# EAGLE schematic Tractive System Schematic (EAGLE 9.6.2)
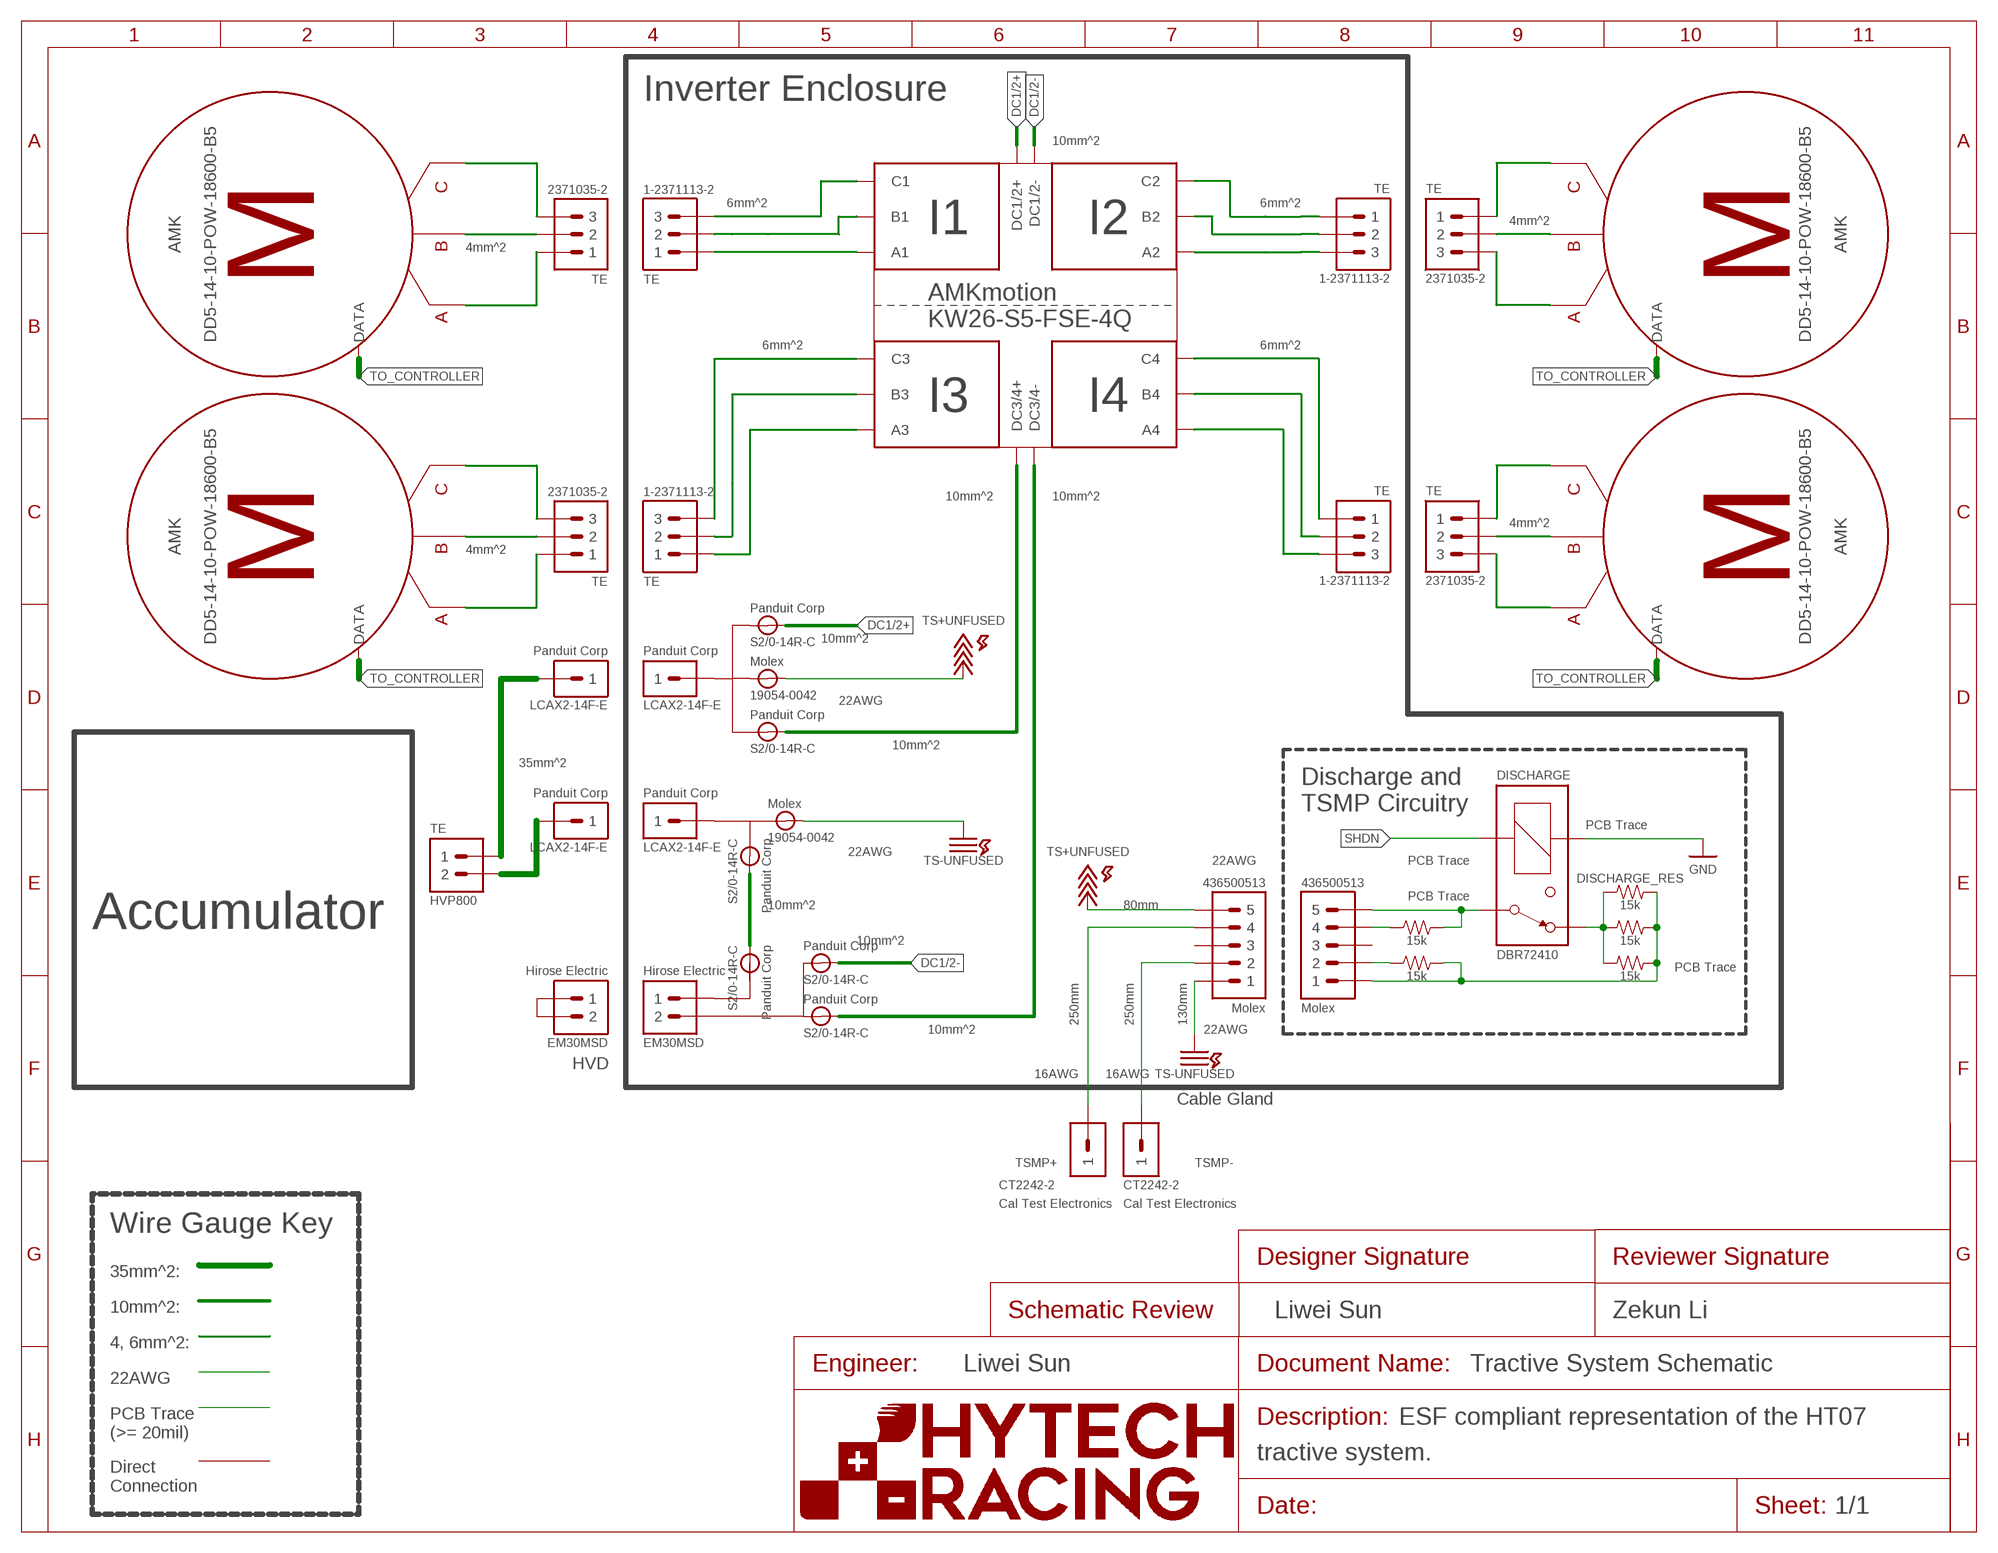
[diagram p0: schematic, sheet 1]
U$4 (FRAME_SCHEMATIC_ONLY): DESCRIPTION_1: ESF compliant representation of the HT07; DESCRIPTION_2: tractive system.; DESIGNER_SCHEMATIC: Liwei Sun; ENGINEER: Liwei Sun; REVIEWER_SCHEMATIC: Zekun Li

## Parts
DISCHARGE  RELAY_SPST_NC_DBR72410  (no package)
DISCHARGE_RES  15k  RESISTOR  (no package)
DISCHARGE_RES1  15k  RESISTOR  (no package)
DISCHARGE_RES2  15k  RESISTOR  (no package)
J1  CONNECTOR-1_CT2242-2  (no package)
J2  CONNECTOR-1_LCAX2-14F-E  (no package)
J3  CONNECTOR-1_CT2242-2  (no package)
J4  RING_TERMINAL_10MM2  (no package)
J5  CONNECTOR-3_2371035-2  (no package)
J6  CONNECTOR-3_2371035-2  (no package)
J7  CONNECTOR-3_2371035-2  (no package)
J8  CONNECTOR-3_2371035-2  (no package)
J9  CONNECTOR-3_1-2371113-2  (no package)
J10  CONNECTOR-3_1-2371113-2  (no package)
J11  CONNECTOR-3_1-2371113-2  (no package)
J12  CONNECTOR-1_LCAX2-14F-E  (no package)
J13  CONNECTOR-3_1-2371113-2  (no package)
J14  RING_TERMINAL_10MM2  (no package)
J15  CONNECTOR-5_436500513  (no package)
J16  CONNECTOR-2_HIROSE  (no package)
J17  CONNECTOR-2_HIROSE  (no package)
J18  RING_TERMINAL_10MM2  (no package)
J19  RING_TERMINAL_10MM2  (no package)
J20  RING_TERMINAL_10MM2  (no package)
J21  CONNECTOR-1_LCAX2-14F-E  (no package)
J22  CONNECTOR-1_LCAX2-14F-E  (no package)
J23  RING_TERMINAL_10MM2  (no package)
J24  RING_TERMINAL_19054-0042  (no package)
J25  RING_TERMINAL_19054-0042  (no package)
J26  CONNECTOR-5_436500513  (no package)
R1  15k  RESISTOR  (no package)
R2  15k  RESISTOR  (no package)
U$1  MOTOR_AC_AMK  (no package)
U$3  CONNECTOR-2_HVP800  (no package)
U$5  MOTOR_AC_AMK  (no package)
U$8  MOTOR_AC_AMK  (no package)
U$9  MOTOR_AC_AMK  (no package)
U$10  AMK_AMKASYN_SIMPLE  (no package)

## Nets
DC1/2+: J19.P$2 U$10.DC1/2+
DC1/2-: J23.P$2 U$10.DC1/2-
GND: DISCHARGE.COIL-
N$1: J5.3 U$1.C
N$2: J5.1 U$1.A
N$4: J5.2 U$1.B
N$5: J6.3 U$5.C
N$6: J6.1 U$5.A
N$7: J6.2 U$5.B
N$8: J7.1 U$8.C
N$9: J7.3 U$8.A
N$10: J7.2 U$8.B
N$11: J8.1 U$9.C
N$12: J12.1 U$3.2
N$14: J26.4 R1.1
N$15: J2.1 U$3.1
N$17: J8.2 U$9.B
N$18: J8.3 U$9.A
N$19: J20.P$2 U$10.DC3/4+
N$20: J14.P$2 U$10.DC3/4-
N$22: J11.2 U$10.B2
N$23: J11.1 U$10.C2
N$24: J9.1 U$10.A1
N$25: J9.2 U$10.B1
N$26: J9.3 U$10.C1
N$27: J13.1 U$10.C4
N$28: J13.2 U$10.B4
N$29: J13.3 U$10.A4
N$30: J10.3 U$10.C3
N$31: J10.2 U$10.B3
N$32: J10.1 U$10.A3
N$33: DISCHARGE.CONTACT1 J26.5 R1.2
N$34: DISCHARGE_RES1.2 DISCHARGE_RES2.2 DISCHARGE_RES.2 J26.1 R2.2
N$37: J4.P$1 J18.P$2
N$41: J26.2 R2.1
N$42: DISCHARGE.CONTACT2 DISCHARGE_RES1.1 DISCHARGE_RES2.1 DISCHARGE_RES.1
N$51: J11.3 U$10.A2
SHDN: DISCHARGE.COIL+
TO_CONTROLLER: U$1.DATA U$5.DATA U$8.DATA U$9.DATA
TS+UNFUSED: J15.5 J24.P$2
TS-UNFUSED: J15.1 J25.P$2
TSMP+: J3.1 J15.4
TSMP-: J1.1 J15.2
Unconnected: J4.P$2 J14.P$1 J15.3 J16.1 J16.2 J17.1 J17.2 J18.P$1 J19.P$1 J20.P$1 J21.1 J22.1 J23.P$1 J24.P$1 J25.P$1 J26.3

## Notes on the sheet
- Inverter Enclosure
- 10mm^2
- 6mm^2 | 6mm^2
- 4mm^2
- 4mm^2
- 6mm^2 | 6mm^2
- 10mm^2 | 10mm^2
- 4mm^2
- 4mm^2
- 10mm^2
- 22AWG
- 10mm^2
- 35mm^2
- Discharge and
  TSMP Circuitry
- PCB Trace
- 22AWG | 22AWG | PCB Trace
- Accumulator | PCB Trace
- 10mm^2 | 80mm
- 10mm^2
- PCB Trace
- 250mm | 250mm | 130mm
- 10mm^2 | 22AWG
- HVD | 16AWG | 16AWG
- Cable Gland
- TSMP-
- TSMP+
- Wire Gauge Key
- 35mm^2:
- 10mm^2:
- 4, 6mm^2:
- 22AWG
- PCB Trace 
  (>= 20mil)
- Direct
  Connection

## Library data of the parts
DISCHARGE = HyTechSymbols:RELAY_SPST_NC_?*: Single pole single throw normally closed relay 3350-4275-126 <https://drive.google.com/file/d/1L0NeZqCX2TFaVQbwFxpbbu9uMJSPuulv/view>; MANUFACTURER: Sensata; MPN: DBR72410
DISCHARGE_RES DISCHARGE_RES1 DISCHARGE_RES2 = HyTechSymbolsTemp:RESISTOR
J1 J3 = HyTechSymbolsTemp:CONNECTOR-1_*: Single pin connector CT2242-2 <https://drive.google.com/file/d/1rFz1F44pFGMLks1TuzNftb-wQBk0xWUD/view> LCAX2-14F-E <https://drive.google.com/file/d/1bbvHAAOUtBwm4fAPUWES_iBsARNVuAgN/view>; MANUFACTURER: Cal Test Electronics; MPN: CT2242-2
J2 J12 = HyTechSymbolsTemp:CONNECTOR-1_*: Single pin connector CT2242-2 <https://drive.google.com/file/d/1rFz1F44pFGMLks1TuzNftb-wQBk0xWUD/view> LCAX2-14F-E <https://drive.google.com/file/d/1bbvHAAOUtBwm4fAPUWES_iBsARNVuAgN/view>; MANUFACTURER: Panduit Corp; MPN: LCAX2-14F-E
J4 J14 J18-J20 J23 = HyTechSymbols:RING_TERMINAL_*: Ring terminal 19054-0042 <https://drive.google.com/drive/folders/1JhKTbRtwaszOvYIb3y-YkBSe0CyrUopM>; MANUFACTURER: Panduit Corp; MPN: S2/0-14R-C
J5-J8 = HyTechSymbols:CONNECTOR-3_*: Three pin connector XXC106-EV-P3Z <https://drive.google.com/file/d/1qR1Rhcju7C1tSf9gvk0xHmD0lfie2p2O/view?usp=sharing> HV02-M3S(40A)-M00A-1 <https://drive.google.com/file/d/14-0BdluqhzWVuxobIuHQclYd8S9S8AFy/view> NEMA-5-20 <https://drive.google.com/file/d/1QyRJhkZq4Jge6F64jD-5aG-LjfEdAoZD/view>; MANUFACTURER: TE; MPN: 2371035-2
J9-J11 J13 = HyTechSymbols:CONNECTOR-3_*: Three pin connector XXC106-EV-P3Z <https://drive.google.com/file/d/1qR1Rhcju7C1tSf9gvk0xHmD0lfie2p2O/view?usp=sharing> HV02-M3S(40A)-M00A-1 <https://drive.google.com/file/d/14-0BdluqhzWVuxobIuHQclYd8S9S8AFy/view> NEMA-5-20 <https://drive.google.com/file/d/1QyRJhkZq4Jge6F64jD-5aG-LjfEdAoZD/view>; MANUFACTURER: TE; MPN: 1-2371113-2
J15 J26 = HyTechSymbols:CONNECTOR-5_*: Five pin connector Micro-Fit 3.0 <https://drive.google.com/file/d/1Be8WGxzm3IeOWSN4qfSP8J4bwHUWCwaO/view>; MANUFACTURER: Molex; MPN: 436500513
J16 J17 = HyTechSymbols:CONNECTOR-2_*: Two pin connector EVH2-N2TK-TDA <https://drive.google.com/file/d/1gQfuywpa-Tm7bohh-tcSjjxbyqcnD_h9/view> HPK <https://drive.google.com/file/d/1jTQMZ26zoHotHQHZYMoMT2jUzRt664sO/view> HVP800 <https://drive.google.com/file/d/1j-HswfqYHj8usJ9E3bf8NWBzB-X0BKJ4/view>; MANUFACTURER: Hirose Electric; MPN: EM30MSD
J21 J22 = HyTechSymbols:CONNECTOR-1_*: Single pin connector CT2242-2 <https://drive.google.com/file/d/1rFz1F44pFGMLks1TuzNftb-wQBk0xWUD/view> LCAX2-14F-E <https://drive.google.com/file/d/1bbvHAAOUtBwm4fAPUWES_iBsARNVuAgN/view>; MANUFACTURER: Panduit Corp; MPN: LCAX2-14F-E
J24 J25 = HyTechSymbols:RING_TERMINAL_*: Ring terminal 19054-0042 <https://drive.google.com/drive/folders/1JhKTbRtwaszOvYIb3y-YkBSe0CyrUopM>; MANUFACTURER: Molex; MPN: 19054-0042
R1 R2 = HyTechSymbols:RESISTOR
U$1 U$5 U$8 U$9 = HyTechSymbols:MOTOR_AC_*: Generic three-phase AC electric motor; MANUFACTURER: AMK; MPN: DD5-14-10-POW-18600-B5
U$3 = HyTechSymbols:CONNECTOR-2_*: Two pin connector EVH2-N2TK-TDA <https://drive.google.com/file/d/1gQfuywpa-Tm7bohh-tcSjjxbyqcnD_h9/view> HPK <https://drive.google.com/file/d/1jTQMZ26zoHotHQHZYMoMT2jUzRt664sO/view> HVP800 <https://drive.google.com/file/d/1j-HswfqYHj8usJ9E3bf8NWBzB-X0BKJ4/view>; MANUFACTURER: TE; MPN: HVP800
U$10 = HyTechSymbols:AMK_AMKASYN_SIMPLE: AMK AMKSYN KW26-S5-FSE-4Q Inverter